# Altium schematic sheet _2_MCU.SchDoc
size B
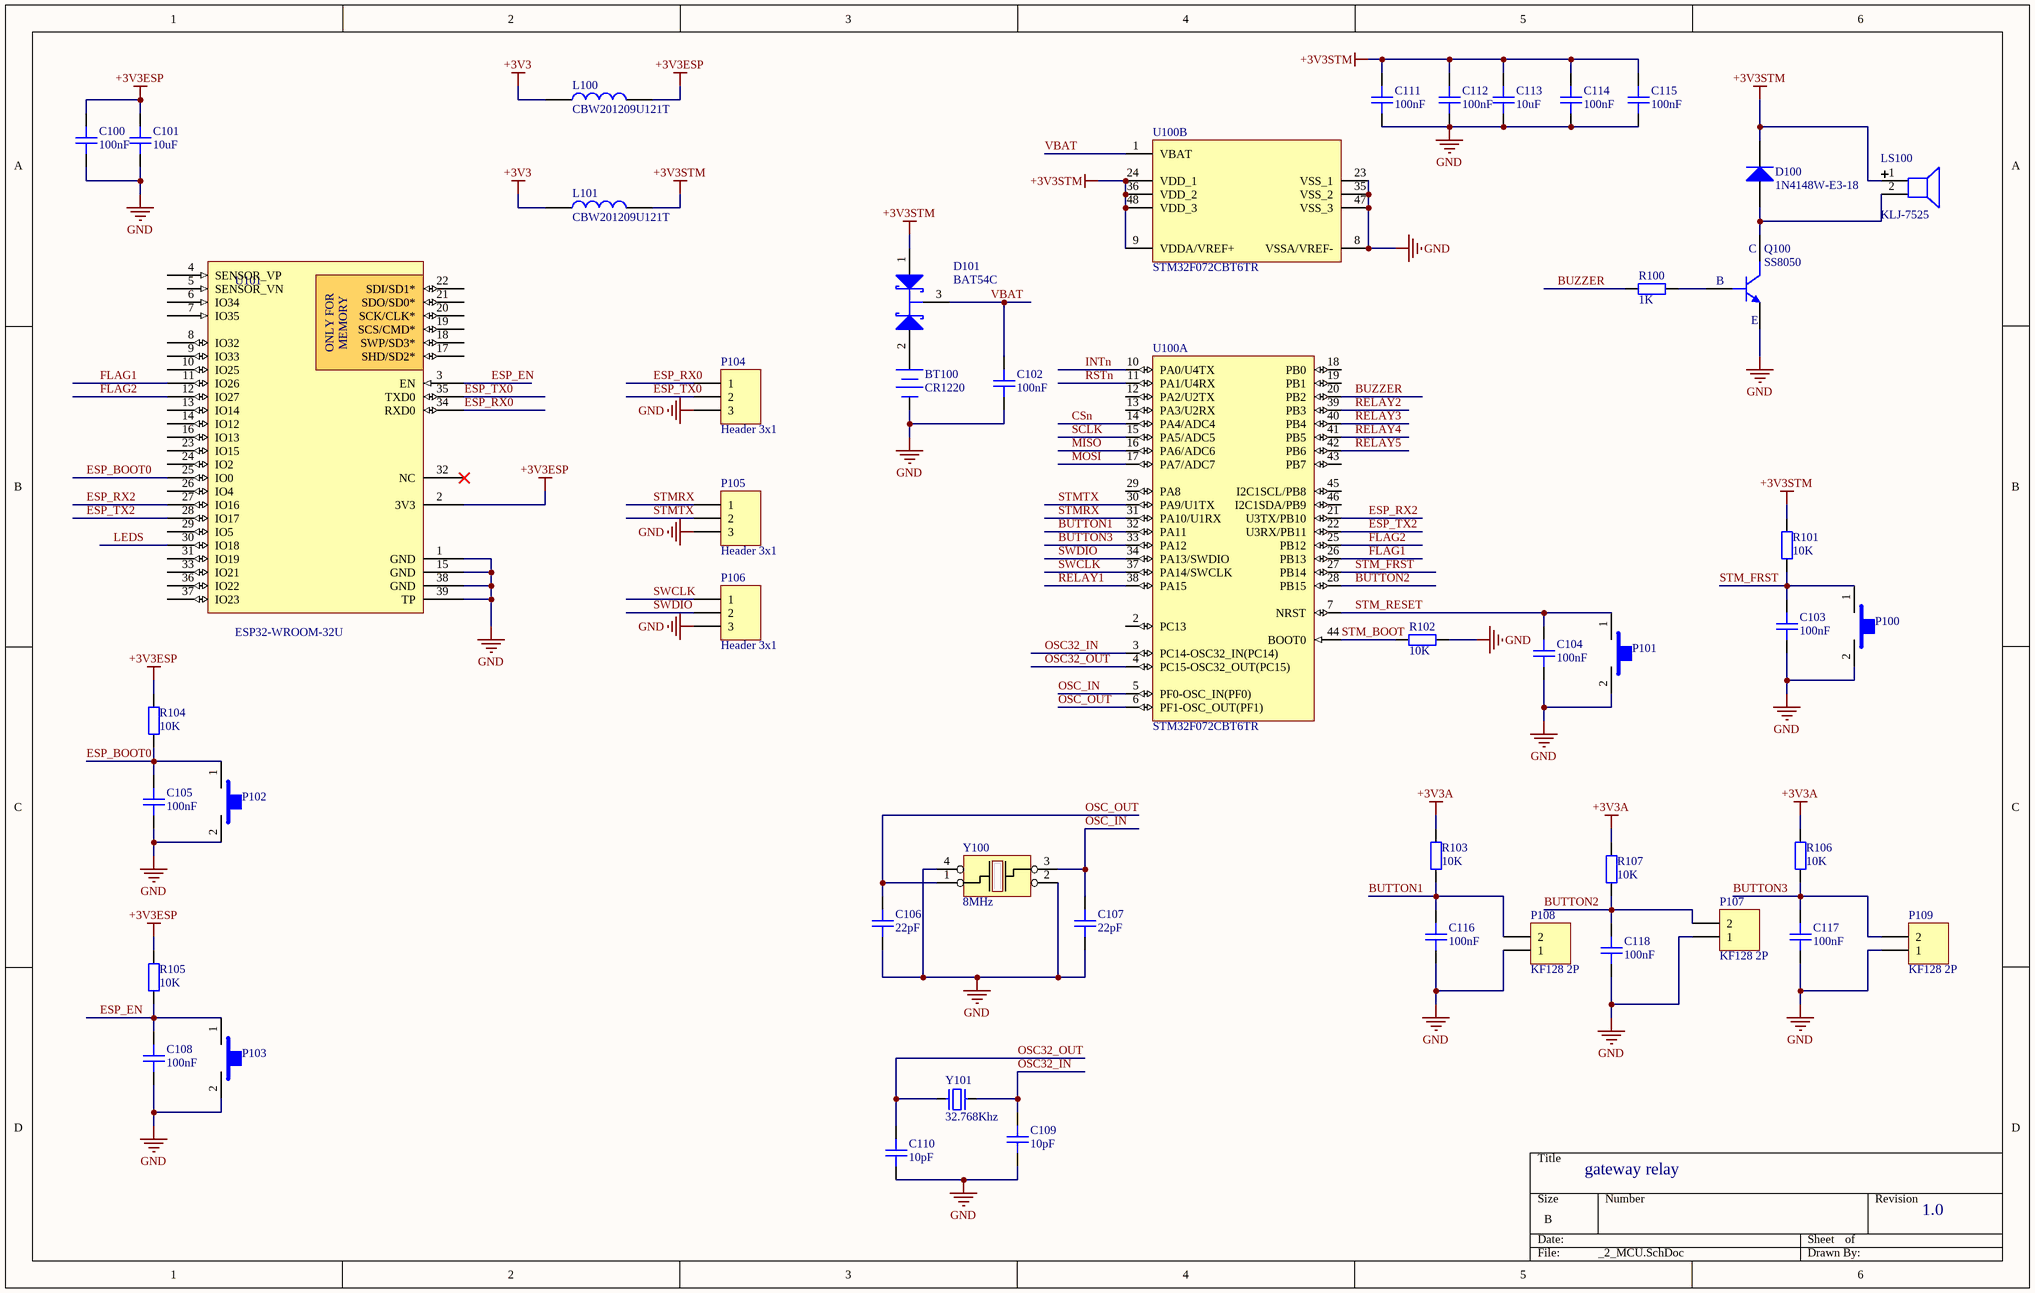
[diagram p0: _2_MCU.SchDoc]

## Parts
BT100  CR1220  [PIN3V-CR1220]
C100  100nF  [CAPC-0603 (1608)]
C101  10uF  [CAPC-0603 (1608)]
C102  100nF  [CAPC-0603 (1608)]
C103  100nF  [CAPC-0603 (1608)]
C104  100nF  [CAPC-0603 (1608)]
C105  100nF  [CAPC-0603 (1608)]
C106  22pF  [CAPC-0603 (1608)]
C107  22pF  [CAPC-0603 (1608)]
C108  100nF  [CAPC-0603 (1608)]
C109  10pF  [CAPC-0603 (1608)]
C110  10pF  [CAPC-0603 (1608)]
C111  100nF  [CAPC-0603 (1608)]
C112  100nF  [CAPC-0603 (1608)]
C113  10uF  [CAPC-0603 (1608)]
C114  100nF  [CAPC-0603 (1608)]
C115  100nF  [CAPC-0603 (1608)]
C116  100nF  [CAPC-0603 (1608)]
C117  100nF  [CAPC-0603 (1608)]
C118  100nF  [CAPC-0603 (1608)]
D100  1N4148W-E3-18  [SOD-123]
D101  BAT54C  [SOT_23_3]
L100  CBW201209U121T  [IND-0805 (2012)]
L101  CBW201209U121T  [IND-0805 (2012)]
LS100  KLJ-7525  [KLJ-7525]
P100  (no value)  [SW 2P SMD]
P101  (no value)  [SW 2P SMD]
P102  (no value)  [SW 2P SMD]
P103  (no value)  [SW 2P SMD]
P104  Header 3x1  [HDR1X3]
P105  Header 3x1  [HDR1X3]
P106  Header 3x1  [HDR1X3]
P107  KF128 2P  [KF128_2P]
P108  KF128 2P  [KF128_2P]
P109  KF128 2P  [KF128_2P]
Q100  SS8050  [SOT23_3]
R100  1K  [RESC-0603 (1608)]
R101  10K  [RESC-0603 (1608)]
R102  10K  [RESC-0603 (1608)]
R103  10K  [RESC-0603 (1608)]
R104  10K  [RESC-0603 (1608)]
R105  10K  [RESC-0603 (1608)]
R106  10K  [RESC-0603 (1608)]
R107  10K  [RESC-0603 (1608)]
U100  STM32F072CBT6TR  [LQFP-48]  (parts A,B of 2)
U101  ESP32-WROOM-32U  [ESP32-WROOM-32U]
Y100  8MHz  [CRYSTALL_SMD_3225]
Y101  32.768Khz  [Thach Anh 2 Chan 32,768 KHz]

## Nets
+3V3: L100.2 L101.1
+3V3A: R103.2 R106.2 R107.2
+3V3ESP: C100.2 C101.2 L100.1 R104.2 R105.2 U101.2(3V3)
+3V3STM: C111.2 C112.2 C113.2 C114.2 C115.2 D100.2(K) D101.1(A) L101.2 LS100.1 R101.2 U100.9(VDDA/VREF+) U100.24(VDD_1) U100.36(VDD_2) U100.48(VDD_3)
GND: BT100.2(-) C100.1 C101.1 C102.1 C103.1 C104.1 C105.1 C106.1 C107.1 C108.1 C109.1 C110.1 C111.1 C112.1 C113.1 C114.1 C115.1 C116.1 C117.1 C118.1 P100.2 P101.2 P102.2 P103.2 P104.3 P105.3 P106.3 P107.1 P108.1 P109.1 Q100.2(E) R102.1 U100.8(VSSA/VREF-) U100.23(VSS_1) U100.35(VSS_2) U100.47(VSS_3) U101.1(GND) U101.15(GND) U101.38(GND) U101.39(TP) Y100.2 Y100.4
BUTTON1: C116.2 P108.2 R103.1 U100.32(PA11)
BUTTON2: C118.2 P107.2 R107.1 U100.28(PB15)
BUTTON3: C117.2 P109.2 R106.1 U100.33(PA12)
BUZZER: R100.2 U100.20(PB2)
CSn: U100.14(PA4/ADC4)
ESP_BOOT0: C105.2 P102.1 R104.1 U101.25(IO0)
ESP_EN: C108.2 P103.1 R105.1 U101.3(EN)
ESP_RX0: P104.1 U101.34(RXD0)
ESP_RX2: U100.21(U3TX/PB10) U101.27(IO16)
ESP_TX0: P104.2 U101.35(TXD0)
ESP_TX2: U100.22(U3RX/PB11) U101.28(IO17)
FLAG1: U100.26(PB13) U101.11(IO26)
FLAG2: U100.25(PB12) U101.12(IO27)
INTn: U100.10(PA0/U4TX)
LEDS: U101.30(IO18)
MISO: U100.16(PA6/ADC6)
MOSI: U100.17(PA7/ADC7)
OSC32_IN: C109.2 U100.3(PC14-OSC32_IN(PC14)) Y101.2
OSC32_OUT: C110.2 U100.4(PC15-OSC32_OUT(PC15)) Y101.1
OSC_IN: C107.2 U100.5(PF0-OSC_IN(PF0)) Y100.3
OSC_OUT: C106.2 U100.6(PF1-OSC_OUT(PF1)) Y100.1
RELAY1: U100.38(PA15)
RELAY2: U100.39(PB3)
RELAY3: U100.40(PB4)
RELAY4: U100.41(PB5)
RELAY5: U100.42(PB6)
RSTn: U100.11(PA1/U4RX)
SCLK: U100.15(PA5/ADC5)
STM_BOOT: R102.2 U100.44(BOOT0)
STM_FRST: C103.2 P100.1 R101.1 U100.27(PB14)
STM_RESET: C104.2 P101.1 U100.7(NRST)
STMRX: P105.1 U100.31(PA10/U1RX)
STMTX: P105.2 U100.30(PA9/U1TX)
SWCLK: P106.1 U100.37(PA14/SWCLK)
SWDIO: P106.2 U100.34(PA13/SWDIO)
VBAT: C102.2 D101.3(K) U100.1(VBAT)
NetBT100_1: BT100.1(+) D101.2(A)
NetD100_1: D100.1(A) LS100.2 Q100.3(C)
NetQ100_1: Q100.1(B) R100.1

Not connected (* = marked no-connect by the designer): U100 2(PC13) 12(PA2/U2TX) 13(PA3/U2RX) 18(PB0) 19(PB1) 29(PA8) 43(PB7) 45(I2C1SCL/PB8) 46(I2C1SDA/PB9); U101 4(SENSOR_VP) 5(SENSOR_VN) 6(IO34) 7(IO35) 8(IO32) 9(IO33) 10(IO25) 13(IO14) 14(IO12) 16(IO13) 17(SHD/SD2*) 18(SWP/SD3*) 19(SCS/CMD*) 20(SCK/CLK*) 21(SDO/SD0*) 22(SDI/SD1*) 23(IO15) 24(IO2) 26(IO4) 29(IO5) 31(IO19) 32(NC)* 33(IO21) 36(IO22) 37(IO23)

## Notes on the sheet
- gateway relay
- 1.0
- (in symbol ESP32-WROOM-32U) ONLY FOR; MEMORY

## Library data of the parts
BT100 = Battery CR1220: Multicell Battery
C100 C111 C112 C114 C115 = CC0603KRX7R7BB105: CAP CER 1uF 10% 16V X7R 0603; Value: 105/16V; CompanyID: VT-00017; Solder: SMT; MPN: CC0603KRX7R7BB105; Category: CAPACITOR; PinCount: 2
C101 C113 = CC0603JRX7R9BB183: CAP CER 0.018UF 50V X7R 0603; MFR: Yageo; Value: 183/50V; Solder: SMT; MPN: CC0603JRX7R9BB183; Category: CAPACITOR; PinCount: 2
C102-C105 C108 C116-C118 = CC0603ZRY5V9BB224: CAP CER 0.22UF 50V Y5V 0603; Value: 224/50V; Solder: SMT; MPN: CC0603ZRY5V9BB224; Category: CAPACITOR; PinCount: 2
C106 C107 = CC0603KRX7R9BB221: CAP CER 220PF 50V 5% COG/NPO 0603; Solder: SMT; CompanyID: VT-01336; Value: 221/50V; MPN: CC0603KRX7R9BB221; Category: CAPACITOR; PinCount: 2
C109 C110 = CC0603CRNPO9BN2R2: CAP CER 2.2pF 50V +- 0.25pF COG/NPO 0603; Solder: SMT; CompanyID: VT-xxxxx; Value: 2P2/50V; MPN: CC0603CRNPO9BN2R2; Category: CAPACITOR; PinCount: 2
D100 = 1N4148-W-7: DIODE GEN PURP 100V 300MA SOD123; MPN: 1N4148W-7-F; MFR: Diodes Incorporated; Solder: SMT; Value: 100V/300MA
D101 = DIO_BAT54C: DIODE ARRAY SCHOTTKY 30V SOT23-3; Manufacturer: On Semiconductor; Cost: 390; Part number: BAT54C; ComponentLink1Description: Link product; ComponentLink1URL: https://www.thegioiic.com/bat54c; Package: SOT-23
L100 L101 = MPZ2012S221A: IND-FERRITE BEAD 220 OHM 0805 1LN; CompanyID: VT-00253; Solder: SMT; Value: 220OHM/3A; MPN: MPZ2012S221A; Category: FERRITE BEAD; PinCount: 2
LS100 = KLJ-7525_BUZZER: Dimension 75x75x25 mm
P100-P103 = Button 2 SMD: SMD Mini Push Button Switch 2 Pin 3x6x2.7mm; MPN: SMD Mini Push Button 2 SMD; Link: https://ram-e-shop.com/product/press2pin-smd/
P104-P106 = Header 3x1: Header, 3-Pin, pitch 2.54mm; Solder: WAVE
P107-P109 = KF128 2P: Header, 2-Pin, pitch 5.08mm; MPN: KF128-2P; Solder: WAVE
Q100 = 2SC1815: TRANS NPN 50V 0.15A SOT23-3; Solder: SMT; MPN: 2SC1815; Value: 2SC1815
R100 = RC0603FR-071KL: RES SMD 1 KOHM 1% 1/10W 0603; CompanyID: VT-00574; Solder: SMT; MPN: RC0603FR-071KL; Value: 1K; Category: RESISTOR
R101-R107 = RC0603FR-0710KL: RES SMD 10K OHM 1% 1/10W 0603; CompanyID: VT-00328; Solder: SMT; MPN: RC0603FR-0710KL; Value: 10K; Category: RESISTOR
U100 = STM32F072CBT6: IC MCU 32BIT 128KB FLASH 48LQFP; MFR: STM; Solder: SMT; Value: STM32F072CBT6TR; MPN: STM32F072CBT6TR; Category: IC
U101 = ESP32-WROOM-32U: Wi-Fi/BT BLE Module ESP32-D0WD; MFR: Espressif; Solder: SMT; Price: None; Value: ESP32-WROOM-32U; Category: MODULE; MPN: ESP32-WROOM-32U; PinCount: 40
Y100 = ABM8G-24.000MHZ-18-D2Y-T: CRYSTAL 24.0000MHZ 18PF SMD; Solder: SMT; CompanyID: VT-xxx; Value: 24MHz; MPN: ABM8G-24.000MHZ-18-D2Y-T; Category: CRYSTAL
Y101 = Thach Anh 2 chan 32,768 Khz: Crystal For all Crystal 2pin.; Value: 4Mhz